# Altium schematic sheet Power.SchDoc
size A4
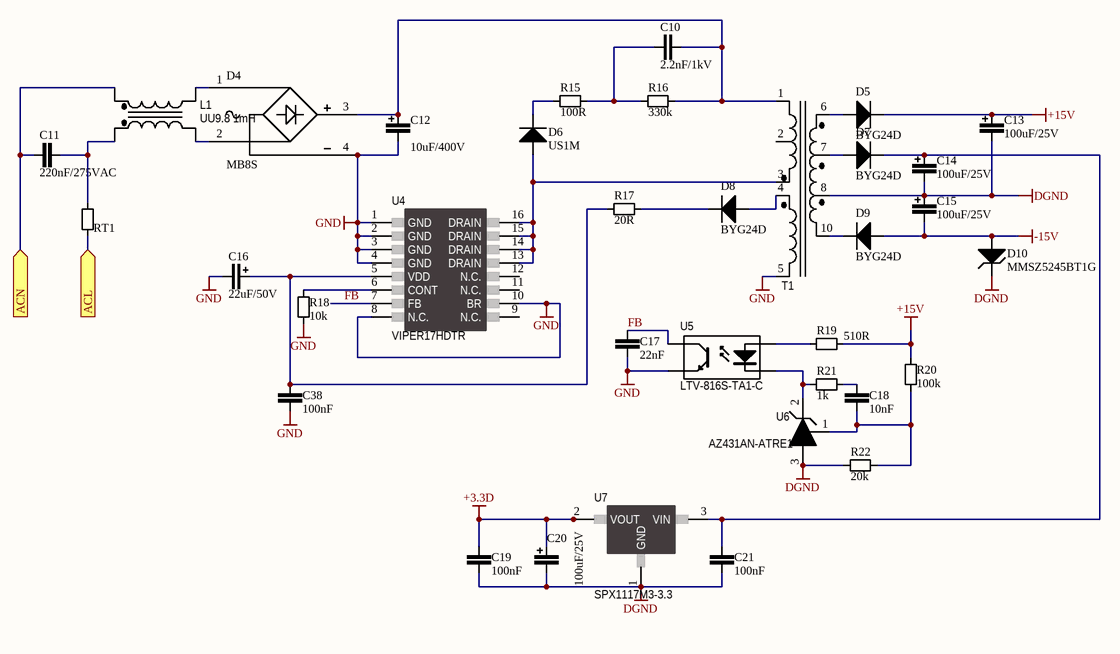
[diagram p0: Power.SchDoc]

## Parts
C10  value 2.2nF/1kV  [1206-C]  (hidden comment: High-Volt Cap)
C11  value 220nF/275VAC  [C-F-C3]  (hidden comment: FILM Cap)
C12  value 10uF/400V  [C-E-ALU-10X16]  (hidden comment: ECap)
C13  value 100uF/25V  [C-E-ALU-6.3X11.5]  (hidden comment: ECap)
C14  value 100uF/25V  [C-E-ALU-6.3X11.5]  (hidden comment: ECap)
C15  value 100uF/25V  [C-E-ALU-6.3X11.5]  (hidden comment: ECap)
C16  value 22uF/50V  [C-E-ALU-5X11]  (hidden comment: ECap)
C17  value 22nF  [0603-C]  (hidden comment: Cap)
C18  value 10nF  [0603-C]  (hidden comment: Cap)
C19  value 100nF  [0603-C]  (hidden comment: Cap)
C20  value 100uF/25V  [C-E-ALU-6.3X11.5]  (hidden comment: ECap)
C21  value 100nF  [0603-C]  (hidden comment: Cap)
C38  value 100nF  [0603-C]  (hidden comment: Cap)
D4  MB8S  [MBS-1]
D5  BYG24D  [DO-214AC]
D6  US1M  [DO-214AC]
D7  BYG24D  [DO-214AC]
D8  BYG24D  [DO-214AC]
D9  BYG24D  [DO-214AC]
D10  MMSZ5245BT1G  [SOD-123]
L1  UU9.8 1mH  [UU9_8]
R15  value 100R  [1206-R]  (hidden comment: Res)
R16  value 330k  [1206-R]  (hidden comment: Res)
R17  value 20R  [1206-R]  (hidden comment: Res)
R18  value 10k  [0603-R]  (hidden comment: Res)
R19  value 510R  [0603-R]  (hidden comment: Res)
R20  value 100k  [0603-R]  (hidden comment: Res)
R21  value 1k  [0603-R]  (hidden comment: Res)
R22  value 20k  [0603-R]  (hidden comment: Res)
RT1  SY16P  [PTC-16P]  (value not drawn)
T1  Transformer  [EE13-5+5-Q9]  (value not drawn)
U4  VIPER17HDTR  [SO-16_N]
U5  LTV-816S-TA1-C  [DIP-4-SMD-OPTO]
U6  AZ431AN-ATRE1  [SOT-23_N]
U7  SPX1117M3-3.3  [SOT223_N]

## Ports
ACL (in), ACN (in)

## Nets
+3.3D: C19.1 C20.1 U7.2(VOUT) U7.4(VOUT)
+15V: C13.1 D5.2(K) R19.1 R20.2
-15V: C15.2 D9.1(A) D10.1(A)
DGND: C13.2 C14.2 C15.1 C19.2 C20.2 C21.1 D10.2(K) R22.2 T1.8 U6.3(IN-) U7.1(GND)
GND: C12.2 C16.2 C17.2 C38.2 D4.4(-) R18.2 T1.5 U4.1(GND) U4.2(GND) U4.3(GND) U4.4(GND) U4.8(N.C.) U4.10(BR) U5.3(E)
ACL: RT1.1 ; port ACL
ACN: C11.1 L1.3(Sec+) ; port ACN
FB: C17.1 U4.7(FB) U5.4(C)
NetC10_1: C10.1 R15.2 R16.2
NetC10_2: C10.2 C12.1 D4.3(+) R16.1 T1.1
NetC11_2: C11.2 L1.1(Pri+) RT1.2
NetC14_1: C14.1 C21.2 D7.2(K) U7.3(VIN)
NetC16_1: C16.1 C38.1 R17.1 U4.5(VDD)
NetC18_1: C18.1 R21.2
NetC18_2: C18.2 R20.1 R22.1 U6.1(OUT)
NetD4_1: D4.1(AC) L1.4(Sec-)
NetD4_2: D4.2(AC) L1.2(Pri-)
NetD5_1: D5.1(A) T1.6
NetD6_1: D6.1(A) T1.3 U4.13(DRAIN) U4.14(DRAIN) U4.15(DRAIN) U4.16(DRAIN)
NetD6_2: D6.2(K) R15.1
NetD7_1: D7.1(A) T1.7
NetD8_1: D8.1(A) T1.4
NetD8_2: D8.2(K) R17.2
NetD9_2: D9.2(K) T1.10
NetR18_1: R18.1 U4.6(CONT)
NetR19_2: R19.2 U5.1(A)
NetR21_1: R21.1 U5.2(K) U6.2(IN+)

Not connected (* = marked no-connect by the designer): T1 2; U4 9(N.C.) 11(N.C.) 12(N.C.)

## Library data of the parts
C10 = C21E02N2K3A0: MLCC 2.2nF 10% 1000V X7R 1206; TemperatureRange: -55°C to 150°C; VenderID: MLCC-1206-1000V-222K-X7R; Published: 1-Jun-2017; Publisher: GreenBox; MountType: SMT; PackageReference: 1206; Manufacturer: *
C11 = CXDM220NKAC0: FILM CAP 220nF 10% 275VAC MPX X2 10mm; TemperatureRange: -40°C to 110°C; Published: 1-Jun-2017; Publisher: GreenBox; MountType: DIP; PackageReference: C3; VenderID: *; Manufacturer: *; PackageDescription: C3, Body 13x6mm, Pitch 10mm
C12 = C3AE010UM2G0: DIP ECAP 10uF 20% 400V 10X16; TemperatureRange: -40°C to 105°C; VenderID: 10uF/400V 20% 10X16; Published: 1-Jun-2017; Publisher: GreenBox; MountType: DIP; PackageReference: 10X16; Manufacturer: *
C13-C15 C20 = C3AC100UM1E0: DIP ECAP 100uF 20% 25V 6.3X11.5; TemperatureRange: -40°C to 105°C; VenderID: 100uF/25V 20% 6.3X11.5; Published: 1-Jun-2017; Publisher: GreenBox; MountType: DIP; PackageReference: 6.3X11.5; Manufacturer: *
C16 = C3AB022UM1H0: DIP ECAP 22uF 20% 50V 5X11; TemperatureRange: -40°C to 105°C; VenderID: 22uF/50V 20% 5X11; Published: 1-Jun-2017; Publisher: GreenBox; MountType: DIP; PackageReference: 5X11; Manufacturer: *
C17 = C21C022NK1H0: MLCC 22nF 10% 50V X7R 0603; TemperatureRange: -55°C to 150°C; VenderID: MLCC-0603-50V-223K-X7R; Published: 1-Jun-2017; Publisher: GreenBox; MountType: SMT; PackageReference: 0603; Manufacturer: *
C18 = C21C010NK1H0: MLCC 10nF 10% 50V X7R 0603; TemperatureRange: -55°C to 150°C; VenderID: MLCC-0603-50V-103K-X7R; Published: 1-Jun-2017; Publisher: GreenBox; MountType: SMT; PackageReference: 0603; Manufacturer: *
C19 C21 C38 = C21C100NK1H0: MLCC 100nF 10% 50V X7R 0603; TemperatureRange: -55°C to 150°C; VenderID: MLCC-0603-50V-104K-X7R; Published: 1-Jun-2017; Publisher: GreenBox; MountType: SMT; PackageReference: 0603; Manufacturer: *
D4 = DBSAMB8S0000: Bridge Rectifiers MB8S 800V 0.5A; Manufacturer: ON SEMICONDUCTOR; TemperatureRange: -55°C to 150°C; Published: 1-Jun-2017; Publisher: GreenBox; PackageReference: MBS-1; MountType: SMT; VenderID: MB8S
D5 D7-D9 = D461BYG24D0V: Fast Recovery Rectifiers BYG24D Vrrm 200V If 1.5A 140nS; Manufacturer: VISHAY; TemperatureRange: -55°C to 150°C; Published: 1-Jun-2017; Publisher: GreenBox; PackageReference: DO-214AC; MountType: SMT; VenderID: BYG24D
D6 = D461US1M0000: Fast Recovery Rectifiers US1M Vrrm 1000V If 1A 75nS; TemperatureRange: -65°C to 150°C; Published: 1-Jun-2017; Publisher: GreenBox; PackageReference: DO-214AC; MountType: SMT; VenderID: US1M; Manufacturer: *
D10 = D531MSZ5245O: Zener Voltage Regulators MMSZ5245BT1G 15V 0W5; Manufacturer: ON SEMICONDUCTOR; TemperatureRange: -55°C to 150°C; Published: 1-Jun-2017; Publisher: GreenBox; PackageReference: SOD-123; MountType: SMT; VenderID: MMSZ5245BT1G
L1 = LCDZUU9801M0: Common Mode Inductor UU9.8 1mH 1A; TemperatureRange: -25 to 80°C; MountType: SMT; Manufacturer: *; PackageReference: UU9_8; Published: 1-Jun-2017; Publisher: GreenBox; VenderID: UU9.8 1mH
R15 = R11E100RFDF0: SMD Resistor 100R 1% 1/4W 1206 100PPM; TemperatureRange: -55°C to 150°C; VenderID: RES-1206-100R-1%; Published: 1-Jun-2017; Publisher: GreenBox; MountType: SMT; PackageReference: 1206; Manufacturer: *
R16 = R11E330KFDF0: SMD Resistor 330k 1% 1/4W 1206 100PPM; TemperatureRange: -55°C to 150°C; VenderID: RES-1206-330k-1%; Published: 1-Jun-2017; Publisher: GreenBox; MountType: SMT; PackageReference: 1206; Manufacturer: *
R17 = R11E020RFDF0: SMD Resistor 20R 1% 1/4W 1206 100PPM; TemperatureRange: -55°C to 150°C; VenderID: RES-1206-20R-1%; Published: 1-Jun-2017; Publisher: GreenBox; MountType: SMT; PackageReference: 1206; Manufacturer: *
R18 = R11C010KFBF0: SMD Resistor 10k 1% 1/10W 0603 100PPM; TemperatureRange: -55°C to 150°C; VenderID: RES-0603-10k-1%; Published: 1-Jun-2017; Publisher: GreenBox; MountType: SMT; PackageReference: 0603; Manufacturer: *
R19 = R11C510RFBF0: SMD Resistor 510R 1% 1/10W 0603 100PPM; TemperatureRange: -55°C to 150°C; VenderID: RES-0603-510R-1%; Published: 1-Jun-2017; Publisher: GreenBox; MountType: SMT; PackageReference: 0603; Manufacturer: *
R20 = R11C100KFBF0: SMD Resistor 100k 1% 1/10W 0603 100PPM; TemperatureRange: -55°C to 150°C; VenderID: RES-0603-100k-1%; Published: 1-Jun-2017; Publisher: GreenBox; MountType: SMT; PackageReference: 0603; Manufacturer: *
R21 = R11C001KFBF0: SMD Resistor 1k 1% 1/10W 0603 100PPM; TemperatureRange: -55°C to 150°C; VenderID: RES-0603-1k-1%; Published: 1-Jun-2017; Publisher: GreenBox; MountType: SMT; PackageReference: 0603; Manufacturer: *
R22 = R11C020KFBF0: SMD Resistor 20k 1% 1/10W 0603 100PPM; TemperatureRange: -55°C to 150°C; VenderID: RES-0603-20k-1%; Published: 1-Jun-2017; Publisher: GreenBox; MountType: SMT; PackageReference: 0603; Manufacturer: *
RT1 = RPDZSY16P000: PTC SY16P; Published: 1-Jun-2017; Publisher: GreenBox; PackageReference: PTC-16P; MountType: DIP; VenderID: PTC SY16P; TemperatureRange: *; Manufacturer: *
T1 = MTD5220050A0: Transformer EE13 GREENBOX 16A Auxiliary Power; Publisher: GreenBox; MountType: DIP; PackageReference: EE13; Published: 1-Jun-2017; TemperatureRange: *; Manufacturer: *; PackageDescription: *; VenderID: *
U4 = UDS3VIPER17S: Switching Regulator VIPER17HDTR 127kHz; Manufacturer: STMicroelectronics; MountType: SMT; PackageReference: SO-16; Published: 1-Jun-2017; Publisher: GreenBox; TemperatureRange: *; VenderID: VIPER17HDTR
U5 = UOSBLTV816SI: Phototransistor Optocoupler LTV-816S-TA1-C Viso 5000Vrms; Manufacturer: LITE-ON ELECTRONICS; TemperatureRange: -30°C to 100°C; MountType: SMT; PackageDescription: DIP-4-SMD-OPTO; 4 Leads; Row Spacing 9mm; Pitch 2.54 mm; PackageReference: LTV-816S; Published: 1-Jun-2017; Publisher: GreenBox; VenderID: LTV-816S-TA1-C
U6 = UV42AZ431ANB: Voltage Reference AZ431AN-ATRE1 Vref 2.5V; Manufacturer: BCD SEMICONDUCTOR; TemperatureRange: -40 to 125°C; Publisher: GreenBox; Published: 1-Jun-2017; MountType: SMT; PackageReference: SOT-23; VenderID: AZ431AN-ATRE1
U7 = UL4111173V3E: LDO SPX1117M3-3.3 3V3 800mA; Manufacturer: SIPEX CORPORATION; TemperatureRange: -40°C to 125°C; Publisher: GreenBox; Published: 1-Jun-2017; PackageReference: SOT-223; MountType: SMT; VenderID: SPX1117M3-3.3